# Altium schematic sheet AM3354BZCZA100​.SchDoc
size D
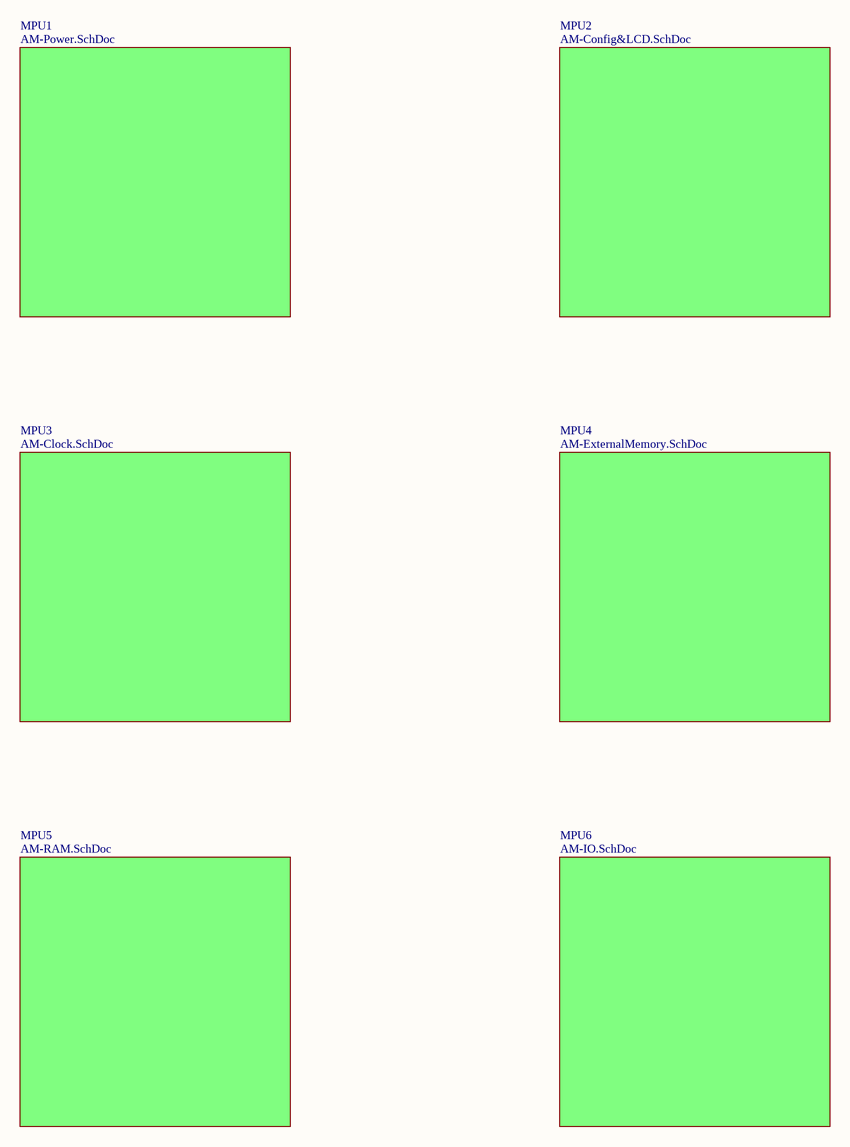
[diagram p0: AM3354BZCZA100​.SchDoc]

## Sub-sheets
MPU1 = AM-Power.SchDoc: no entries
MPU2 = AM-Config&LCD.SchDoc: no entries
MPU3 = AM-Clock.SchDoc: no entries
MPU4 = AM-ExternalMemory.SchDoc: no entries
MPU5 = AM-RAM.SchDoc: no entries
MPU6 = AM-IO.SchDoc: no entries

## Notes on the sheet
- Title
- Size:
- Date:
- File:
- D
- Number:
- Time:
- Revision:
- Sheet
- of